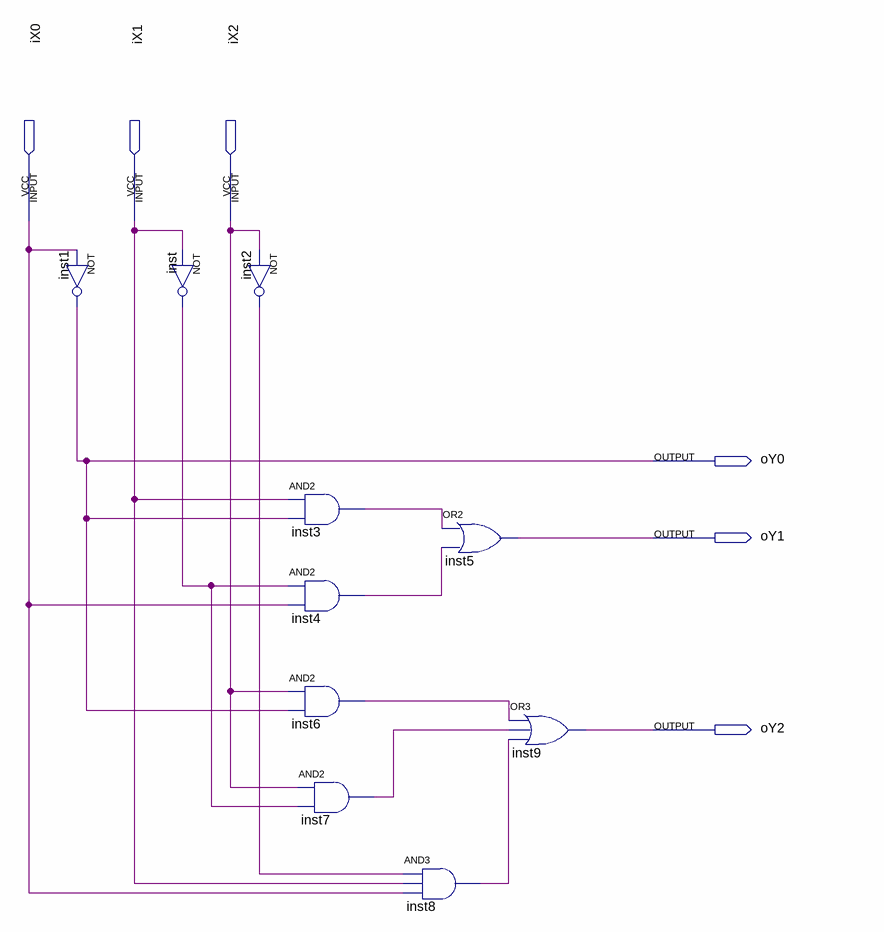
[diagram p0: schematic sheet]
// Quartus schematic SecondDigitalSystem.bdf as structural Verilog: 10 symbols, 6 pins
module SecondDigitalSystem (
  input  iX0,
  input  iX1,
  input  iX2,
  output oY0,
  output oY1,
  output oY2
);

  wire inst2_out, inst3_out, inst4_out, inst6_out, inst7_out, inst8_out, inst_out;

  not inst1 (oY0, iX0);
  not inst (inst_out, iX1);
  not inst2 (inst2_out, iX2);
  and inst3 (inst3_out, iX1, oY0);
  and inst4 (inst4_out, inst_out, iX0);
  and inst6 (inst6_out, iX2, oY0);
  and inst7 (inst7_out, iX2, inst_out);
  or inst5 (oY1, inst3_out, inst4_out);
  and inst8 (inst8_out, inst2_out, iX1, iX0);
  or inst9 (oY2, inst6_out, inst7_out, inst8_out);
endmodule
